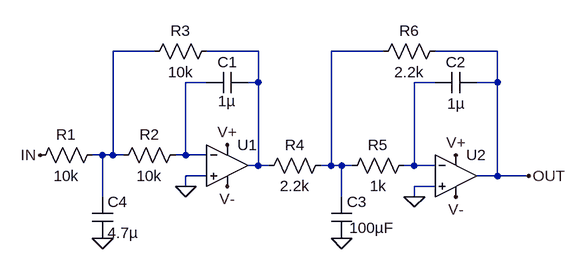
[diagram p0: schematic LowPass-Filter.asc]
LowPass-Filter.asc, the LTspice schematic file:
Version 4.1
SHEET 1 1276 1060
WIRE -592 144 -656 144
WIRE -432 144 -512 144
WIRE -240 144 -320 144
WIRE -64 144 -160 144
WIRE -512 192 -544 192
WIRE -432 192 -432 144
WIRE -432 192 -448 192
WIRE -160 192 -192 192
WIRE -64 192 -64 144
WIRE -64 192 -96 192
WIRE -672 304 -688 304
WIRE -656 304 -656 144
WIRE -656 304 -672 304
WIRE -640 304 -656 304
WIRE -544 304 -544 192
WIRE -544 304 -560 304
WIRE -512 304 -544 304
WIRE -432 320 -432 192
WIRE -432 320 -448 320
WIRE -416 320 -432 320
WIRE -320 320 -320 144
WIRE -320 320 -336 320
WIRE -304 320 -320 320
WIRE -288 320 -304 320
WIRE -192 320 -192 192
WIRE -192 320 -208 320
WIRE -160 320 -192 320
WIRE -512 336 -544 336
WIRE -64 336 -64 192
WIRE -64 336 -96 336
WIRE -16 336 -64 336
WIRE -544 352 -544 336
WIRE -160 352 -192 352
WIRE -672 368 -672 304
WIRE -304 368 -304 320
WIRE -192 368 -192 352
FLAG -304 432 0
FLAG -192 368 0
FLAG -544 352 0
FLAG -768 304 IN
FLAG -16 336 OUT
FLAG -128 304 V+
FLAG -480 288 V+
FLAG -480 352 V-
FLAG -128 368 V-
FLAG -672 432 0
SYMBOL res -672 288 R90
WINDOW 0 0 56 VBottom 2
WINDOW 3 32 56 VTop 2
SYMATTR InstName R1
SYMATTR Value 10k
SYMBOL OpAmps\\UniversalOpAmp -480 320 R0
SYMATTR InstName U1
SYMBOL OpAmps\\UniversalOpAmp -128 336 R0
SYMATTR InstName U2
SYMBOL res -544 288 R90
WINDOW 0 0 56 VBottom 2
WINDOW 3 32 56 VTop 2
SYMATTR InstName R2
SYMATTR Value 10k
SYMBOL res -496 128 R90
WINDOW 0 0 56 VBottom 2
WINDOW 3 32 56 VTop 2
SYMATTR InstName R3
SYMATTR Value 10k
SYMBOL cap -448 176 R90
WINDOW 0 0 32 VBottom 2
WINDOW 3 29 33 VTop 2
SYMATTR InstName C1
SYMATTR Value 1µ
SYMATTR SpiceLine V=50 Irms=36m Rser=3.5 Lser=0 mfg="Nichicon" pn="UPL1H010MAH" type="Al electrolytic"
SYMBOL res -320 304 R90
WINDOW 0 0 56 VBottom 2
WINDOW 3 32 56 VTop 2
SYMATTR InstName R4
SYMATTR Value 2.2k
SYMBOL res -192 304 R90
WINDOW 0 0 56 VBottom 2
WINDOW 3 32 56 VTop 2
SYMATTR InstName R5
SYMATTR Value 1k
SYMBOL res -144 128 R90
WINDOW 0 0 56 VBottom 2
WINDOW 3 32 56 VTop 2
SYMATTR InstName R6
SYMATTR Value 2.2k
SYMBOL cap -320 368 R0
WINDOW 3 28 48 Left 2
SYMATTR Value 100µF
SYMATTR InstName C3
SYMBOL cap -96 176 R90
WINDOW 0 0 32 VBottom 2
WINDOW 3 33 32 VTop 2
SYMATTR InstName C2
SYMATTR Value 1µ
SYMATTR SpiceLine V=50 Irms=36m Rser=3.5 Lser=0 mfg="Nichicon" pn="UPL1H010MAH" type="Al electrolytic"
SYMBOL cap -688 368 R0
SYMATTR Value 4.7µ
SYMATTR InstName C4
SYMATTR SpiceLine V=25 Irms=15m Rser=2.2 Lser=200f mfg="Würth Elektronik" pn="865090468011 WCAP-ASLU 3.5x3.3" type="Al electrolytic"

The netlist it stands for:
* LowPass-Filter.asc
R1 N001 IN 10k
X§U1 0 N004 V+ V- N002 level1 Avol=1Meg GBW=10Meg Vos=0 En=0 Enk=0 In=0 Ink=0 Rin=500Meg  ; pins In+ In- V+ V- OUT
X§U2 0 N005 V+ V- OUT level1 Avol=1Meg GBW=10Meg Vos=0 En=0 Enk=0 In=0 Ink=0 Rin=500Meg  ; pins In+ In- V+ V- OUT
R2 N004 N001 10k
R3 N002 N001 10k
C1 N002 N004 1µ V=50 Irms=36m Rser=3.5 Lser=0 mfg="Nichicon" pn="UPL1H010MAH" type="Al electrolytic"
R4 N003 N002 2.2k
R5 N005 N003 1k
R6 OUT N003 2.2k
C3 N003 0 100µF
C2 OUT N005 1µ V=50 Irms=36m Rser=3.5 Lser=0 mfg="Nichicon" pn="UPL1H010MAH" type="Al electrolytic"
C4 N001 0 4.7µ V=25 Irms=15m Rser=2.2 Lser=200f mfg="Würth Elektronik" pn="865090468011 WCAP-ASLU 3.5x3.3" type="Al electrolytic"
.lib UniversalOpAmp1.lib
.backanno
.end